# Altium schematic sheet Grove Breakout Board.SchDoc
size B
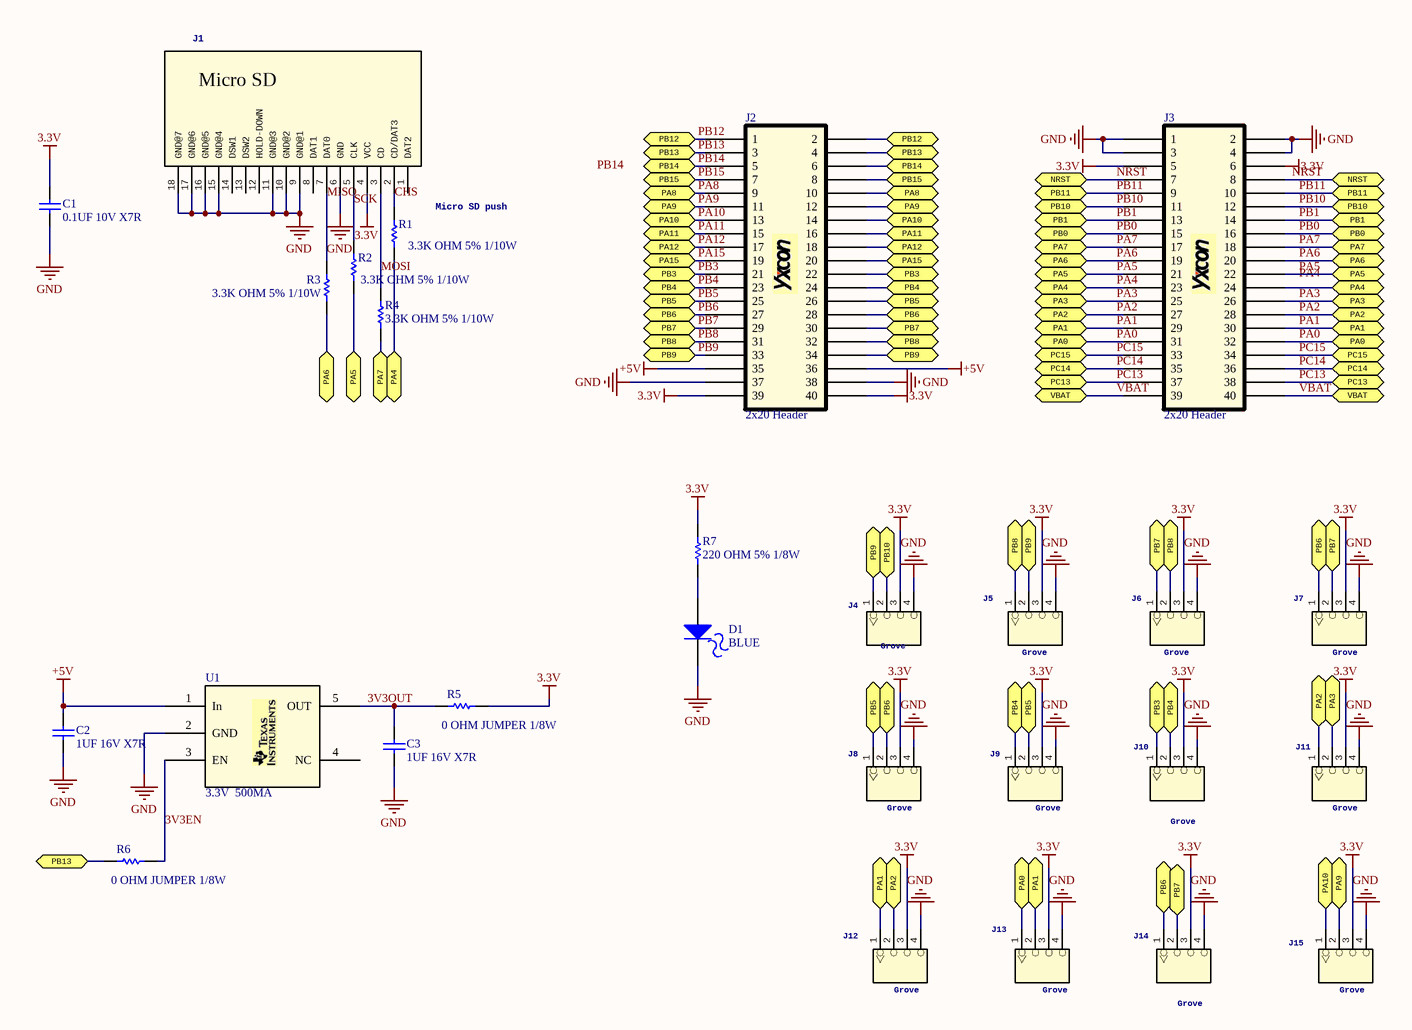
[diagram p0: Grove Breakout Board.SchDoc]

## Parts
C1  0.1UF 10V X7R  [SMD-0603C]
C2  1UF 16V X7R  [SMD-0603C]
C3  1UF 16V X7R  [SMD-0603C]
D1  BLUE  [0603 LED BLUE]
J1  Micro SD push  [JAE_ST11H_MicroSD]
J2  2x20 Header  [2.54mm 2x20 8.5mm 5 mm]
J3  2x20 Header  [2.54mm 2x20 8.5mm 5 mm]
J4  Grove  [HW4-2.0 - Straight]
J5  Grove  [HW4-2.0 - Straight]
J6  Grove  [HW4-2.0 - Straight]
J7  Grove  [HW4-2.0 - Straight]
J8  Grove  [HW4-2.0 - Straight]
J9  Grove  [HW4-2.0 - Straight]
J10  Grove  [HW4-2.0 - Straight]
J11  Grove  [HW4-2.0 - Straight]
J12  Grove  [HW4-2.0 - Straight]
J13  Grove  [HW4-2.0 - Straight]
J14  Grove  [HW4-2.0 - Straight]
J15  Grove  [HW4-2.0 - Straight]
R1  3.3K OHM 5% 1/10W  [SMD-0603-RES]
R2  3.3K OHM 5% 1/10W  [SMD-0603-RES]
R3  3.3K OHM 5% 1/10W  [SMD-0603-RES]
R4  3.3K OHM 5% 1/10W  [SMD-0603-RES]
R5  0 OHM JUMPER 1/8W  [SMD-0805-RES]
R6  0 OHM JUMPER 1/8W  [SMD-0805-RES]
R7  220 OHM 5% 1/8W  [SMD-0805-RES]
U1  3.3V  500MA  [SOT-23-5 TI]

## Ports
NRST, PA0, PA1, PA2, PA3, PA4, PA5, PA6, PA7, PA8, PA9, PA10, PA11, PA12, PA15, PB0, PB1, PB3, PB4, PB5, PB6, PB7, PB8, PB9, PB10, PB11, PB12, PB13, PB14, PB15, PC13, PC14, PC15, VBAT

## Nets
3.3V: C1.1 J1.4(VCC) J2.39 J2.40 J3.5 J3.6 J4.3 J5.3 J6.3 J7.3 J8.3 J9.3 J10.3 J11.3 J12.3 J13.3 J14.3 J15.3 R5.2 R7.2
+5V: C2.2 J2.35 J2.36 U1.1(In)
GND: C1.2 C2.1 C3.1 D1.2(Cathode) J1.6(GND) J1.9(GND@1) J1.10(GND@2) J1.11(GND@3) J1.15(GND@4) J1.16(GND@5) J1.17(GND@6) J1.18(GND@7) J2.37 J2.38 J3.1 J3.2 J3.3 J3.4 J4.4 J5.4 J6.4 J7.4 J8.4 J9.4 J10.4 J11.4 J12.4 J13.4 J14.4 J15.4 U1.2(GND)
3V3EN: R6.2 U1.3(EN)
3V3OUT: C3.2 R5.1 U1.5(OUT)
CHS: J1.2(CD/DAT3) R1.2
MISO: J1.7(DAT0) R3.2
MOSI: J1.3(CD) R4.1
NRST: J3.7 J3.8 ; port NRST
PA0: J3.31 J3.32 J13.1 ; port PA0
PA1: J3.29 J3.30 J12.1 J13.2 ; port PA1
PA2: J3.27 J3.28 J11.1 J12.2 ; port PA2
PA3: J3.25 J3.26 J11.2 ; port PA3
PA4: J3.23 J3.24 R1.1 ; port PA4
PA5: J3.21 J3.22 R2.1 ; port PA5
PA6: J3.19 J3.20 R3.1 ; port PA6
PA7: J3.17 J3.18 R4.2 ; port PA7
PA8: J2.9 J2.10 ; port PA8
PA9: J2.11 J2.12 J15.2 ; port PA9
PA10: J2.13 J2.14 J15.1 ; port PA10
PA11: J2.15 J2.16 ; port PA11
PA12: J2.17 J2.18 ; port PA12
PA15: J2.19 J2.20 ; port PA15
PB0: J3.15 J3.16 ; port PB0
PB1: J3.13 J3.14 ; port PB1
PB3: J2.21 J2.22 J10.1 ; port PB3
PB4: J2.23 J2.24 J9.1 J10.2 ; port PB4
PB5: J2.25 J2.26 J8.1 J9.2 ; port PB5
PB6: J2.27 J2.28 J7.1 J8.2 J14.1 ; port PB6
PB7: J2.29 J2.30 J6.1 J7.2 J14.2 ; port PB7
PB8: J2.31 J2.32 J5.1 J6.2 ; port PB8
PB9: J2.33 J2.34 J4.1 J5.2 ; port PB9
PB10: J3.11 J3.12 J4.2 ; port PB10
PB11: J3.9 J3.10 ; port PB11
PB12: J2.1 J2.2 ; port PB12
PB13: J2.3 J2.4 R6.1 ; port PB13
PB14: J2.5 J2.6 ; port PB14
PB15: J2.7 J2.8 ; port PB15
PC13: J3.37 J3.38 ; port PC13
PC14: J3.35 J3.36 ; port PC14
PC15: J3.33 J3.34 ; port PC15
SCK: J1.5(CLK) R2.2
VBAT: J3.39 J3.40 ; port VBAT
NetD1_1: D1.1(Anode) R7.1

Not connected (* = marked no-connect by the designer): J1 1(DAT2) 8(DAT1) 12(HOLD-DOWN) 13(DSW2) 14(DSW1); U1 4(NC)

## Notes on the sheet
- Labels drawn without touching a wire or pin: PA4, PB14
- (in symbol ST11S008V4HR2000) Micro SD

## Library data of the parts
C1 = 885012206020: CAP CER 0.1UF 10V X7R 0603; Manufacturer: Wurth Electronics Inc.; Number: 885012206020
C2 C3 = CL10B105MO8NNWC: CAP CER 1UF 16V X7R 0603; Manufacturer: Samsung Electro-Mechanics; Number: CL10B105MO8NNWC
D1 = LTST-C190TBKT: LED BLUE CLEAR CHIP SMD; Manufacturer: Lite-On Inc.; Number: LTST-C190TBKT
J1 = ST11S008V4HR2000: CONN MICRO SD CARD PUSH-PUSH R/A; Manufacturer: JAE Electronics; Number: ST11S008V4HR2000
J2 J3 = F185-1220A0BSYA1: 2x20 Header 2.54 mm 5 mm x 8.5 mm; Manufacturer: Xycon; Number: F185-1220A0BSYA1
J4-J15 = 320110033: GROVE 2MM 4PIN CONN 10PACK; Manufacturer: Seeed Technology Co., Ltd; Alter Number: 110990030; Number: 320110033
R1-R4 = RC0603JR-073K3L: RES SMD 3.3K OHM 5% 1/10W 0603; Manufacturer: Yageo; Number: RC0603JR-073K3L
R5 R6 = RC0805JR-070RL: RES SMD 0 OHM JUMPER 1/8W 0805; Manufacturer: Yageo; Number: RC0805JR-070RL
R7 = RC0805JR-07220RL: RES SMD 220 OHM 5% 1/8W 0805; Manufacturer: Yageo; Number: RC0805JR-07220RL
U1 = TLV75533PDBVR: IC REG LINEAR 3.3V 500MA SOT23-5; Manufacturer: Texas Instruments; Number: TLV75533PDBVR